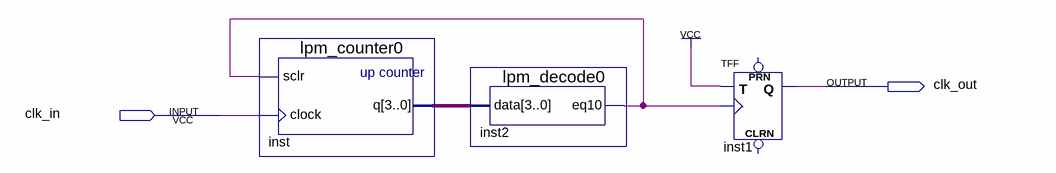
[diagram p0: schematic sheet]
// Quartus schematic clk_divider.bdf as structural Verilog: 3 symbols, 2 pins
module clk_divider (
  input  clk_in,
  output clk_out
);

  wire inst2_eq10;
  wire [3:0] inst_q;

  lpm_counter0 inst (.sclr(inst2_eq10), .clock(clk_in), .q(inst_q));
  lpm_decode0 inst2 (.data(inst_q), .eq10(inst2_eq10));
  TFF inst1 (.T(1'b1), .CLK(inst2_eq10), .Q(clk_out));  // open: PRN, CLRN
endmodule
